# EAGLE schematic jr-support_v3 (EAGLE 8.2.1)
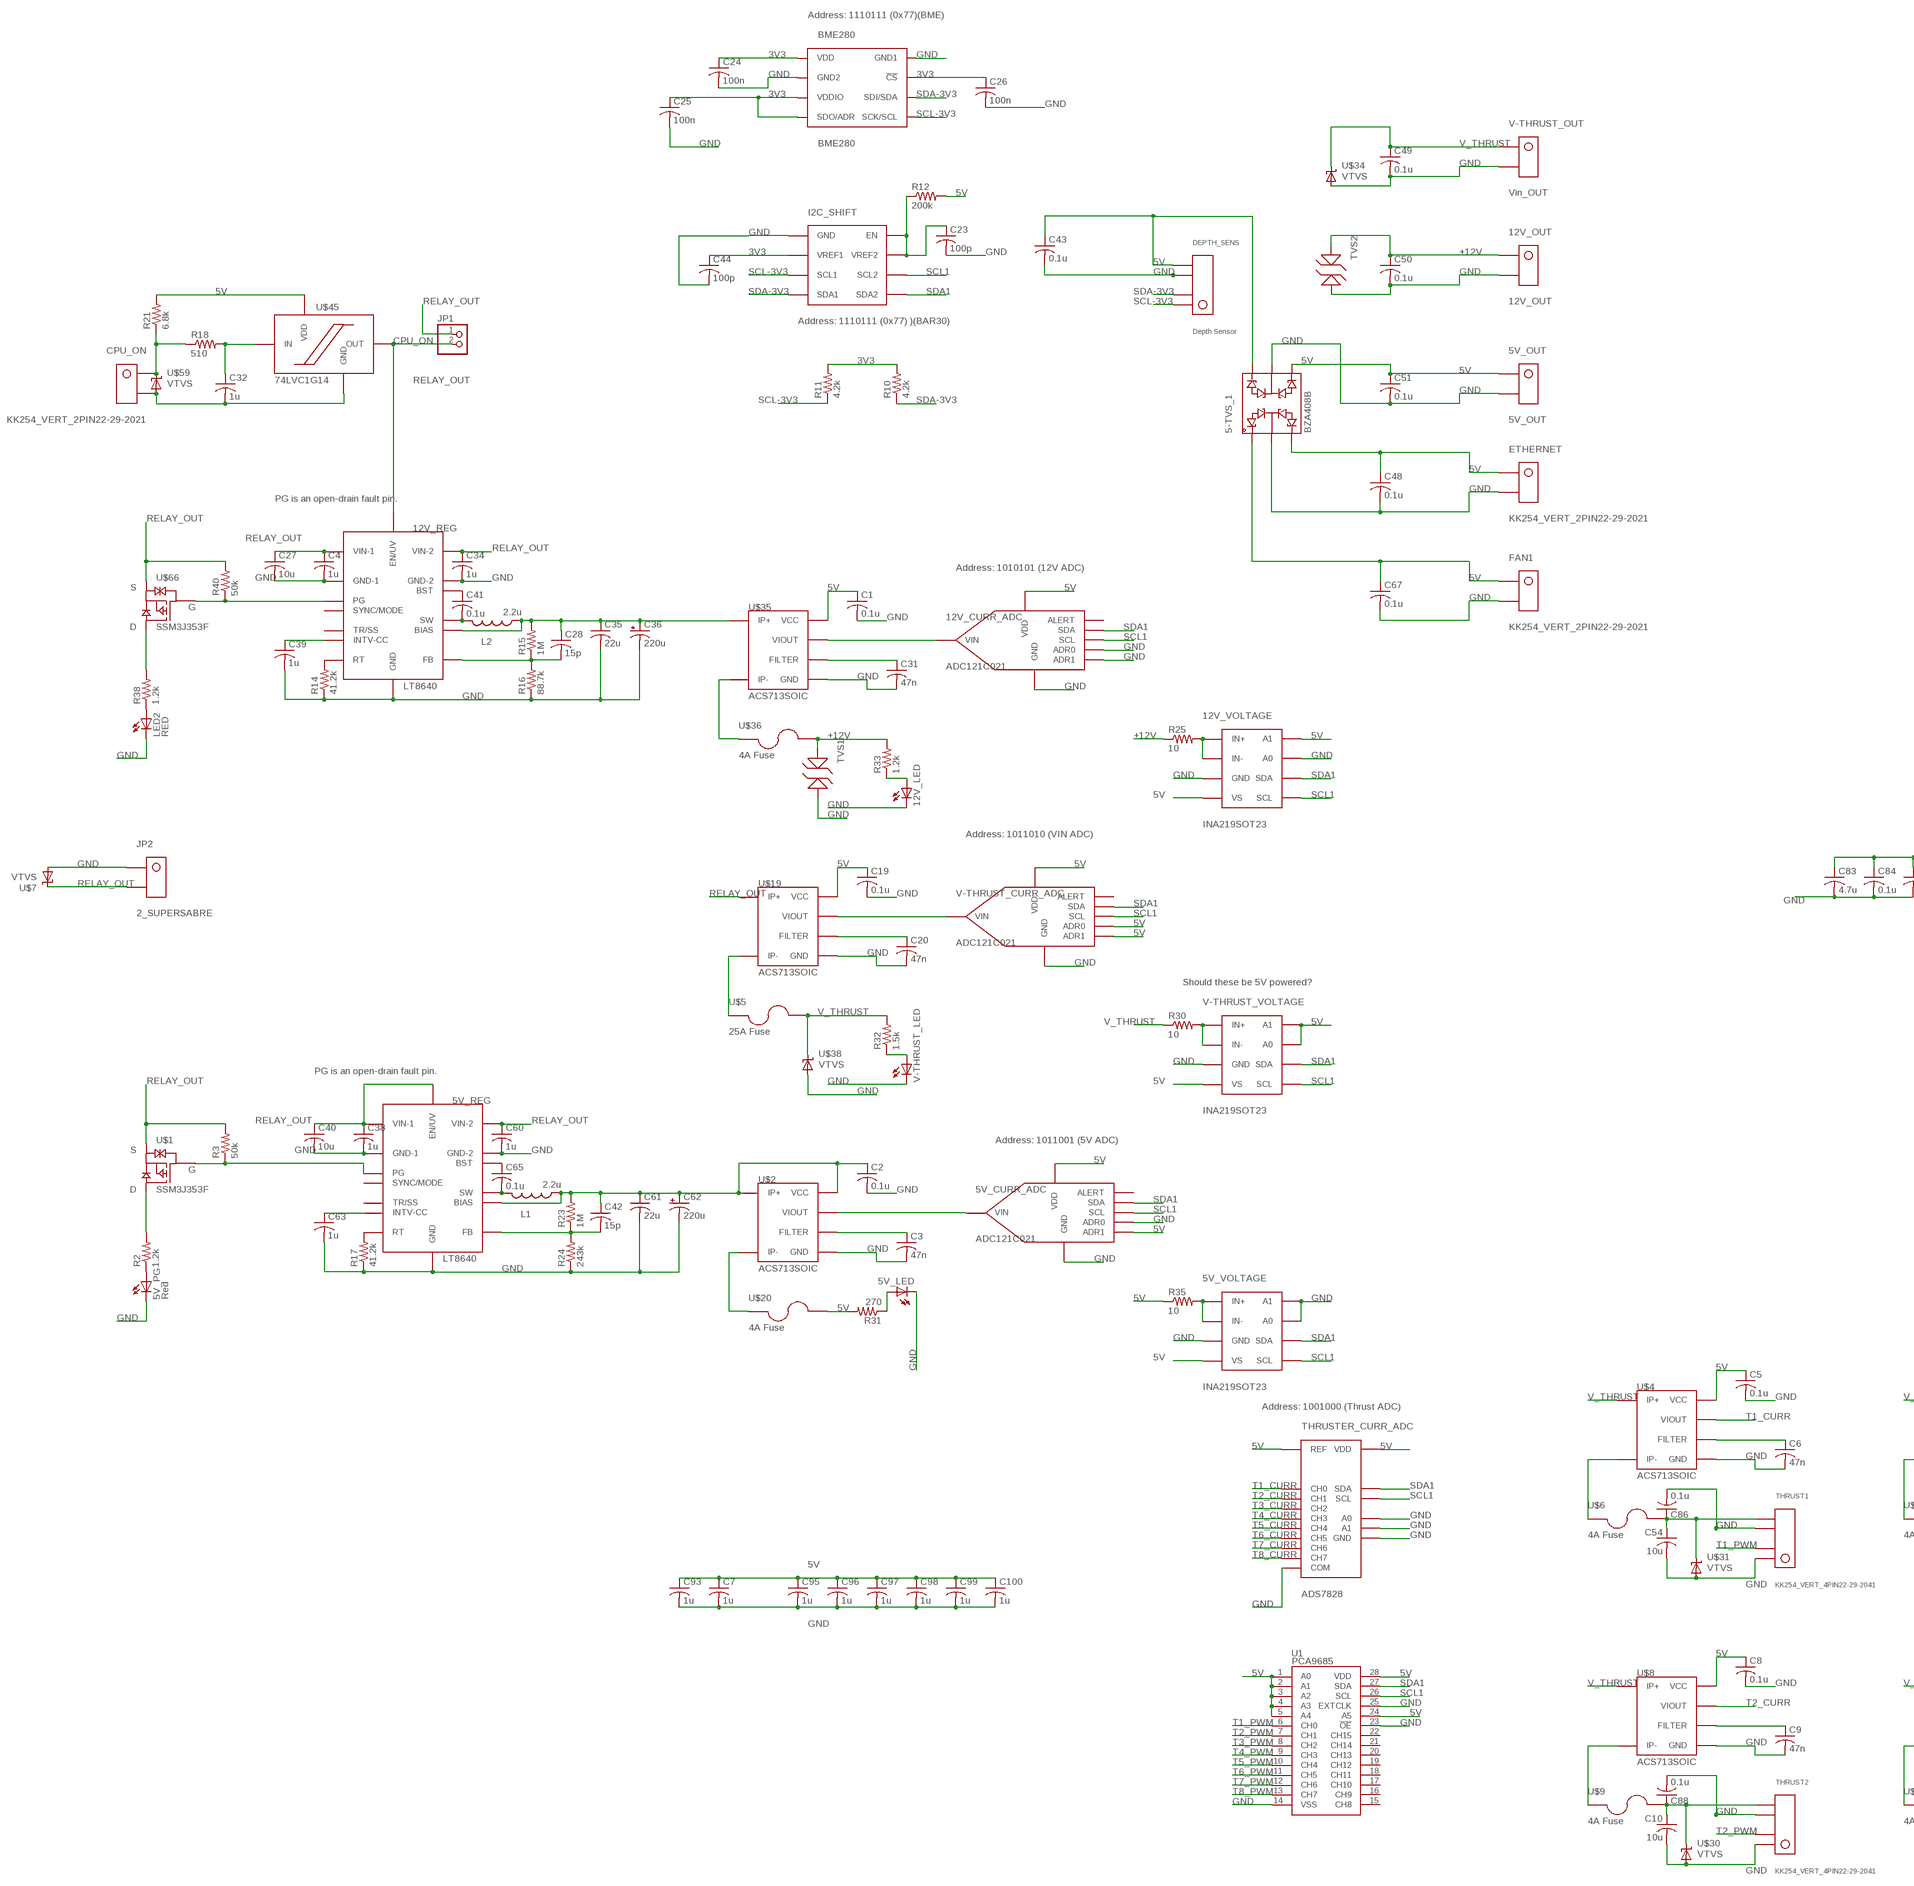
[diagram p0: schematic, sheet 1, part 1 of 2]
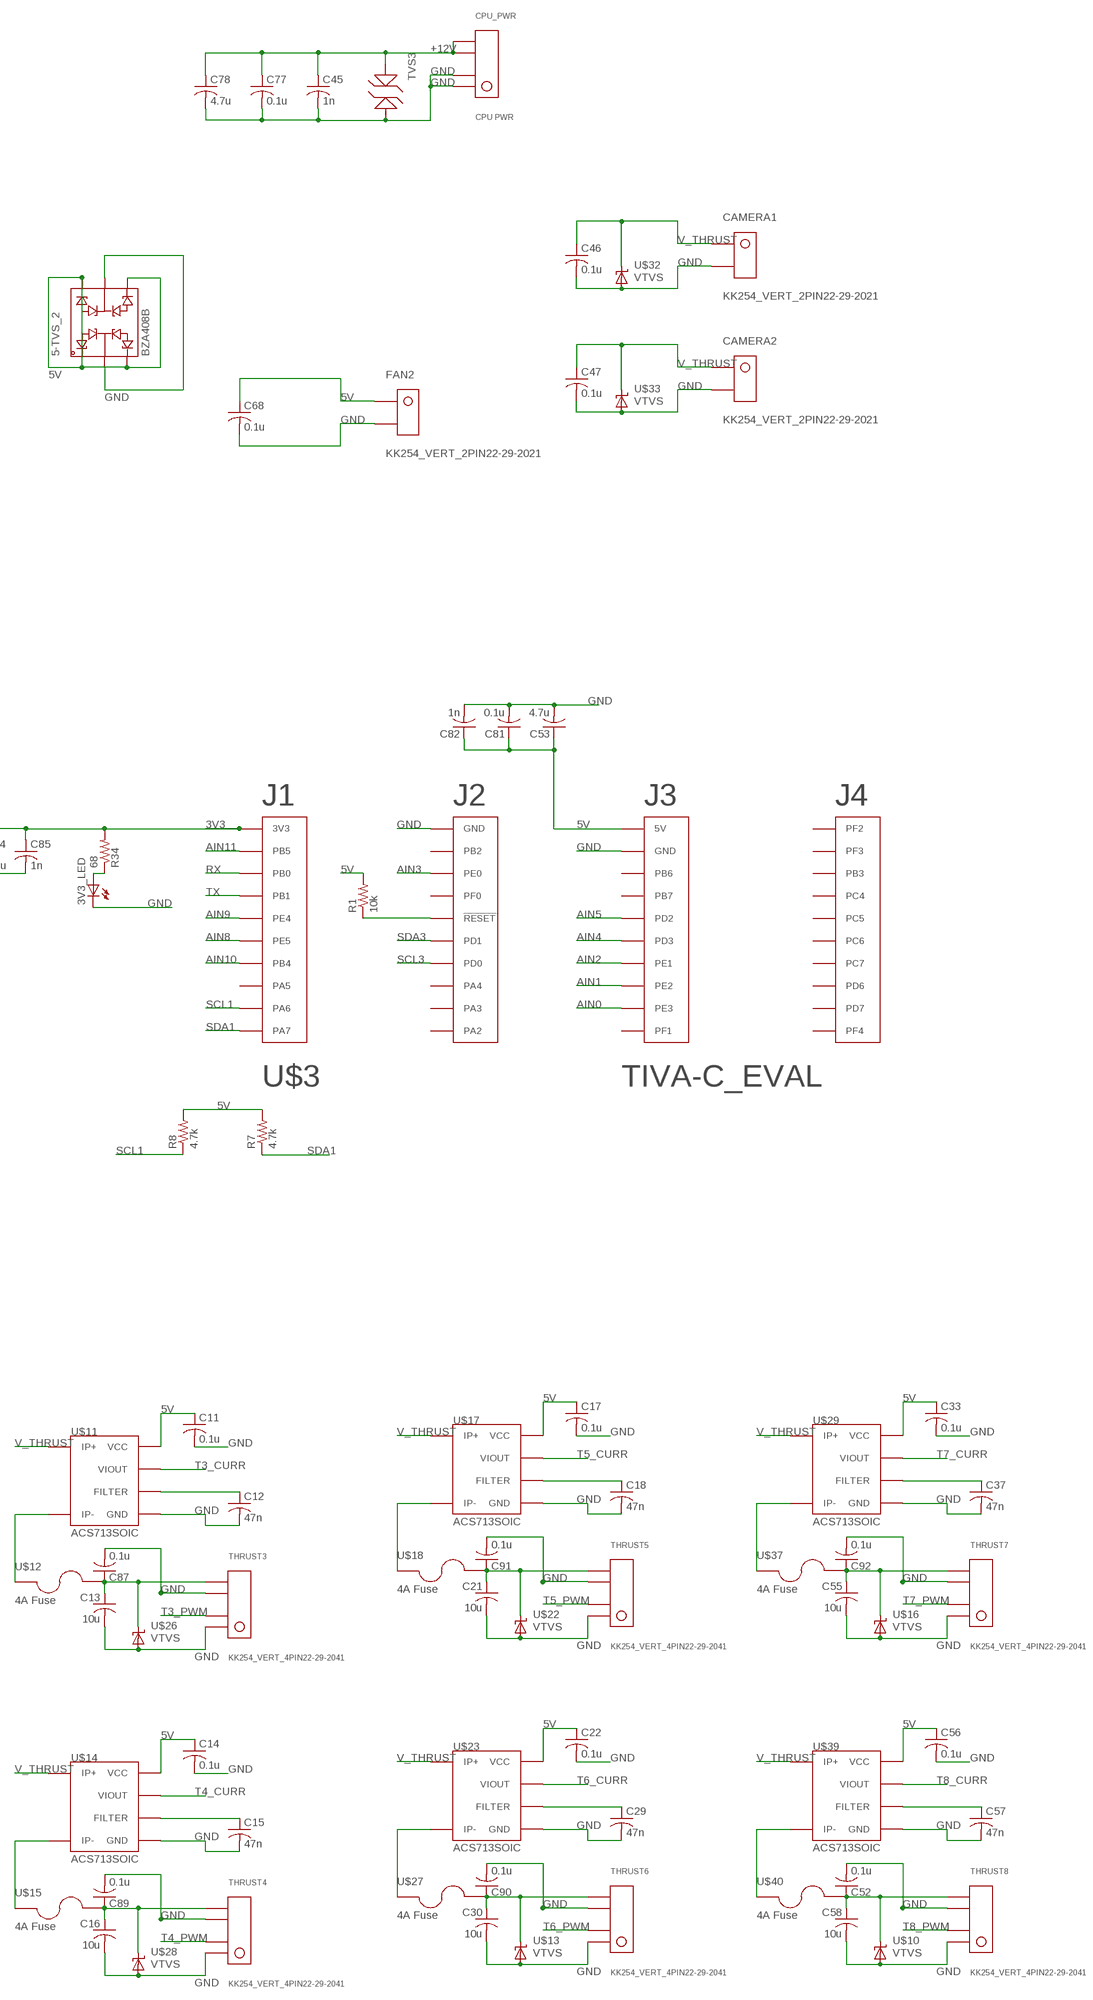
[diagram p1: schematic, sheet 1, part 2 of 2]

## Parts
3V3_LED  0805_LED  [0805]
5-TVS_1  BZA408B  [SOT457]
5-TVS_2  BZA408B  [SOT457]
5V_CURR_ADC  ADC121C021  [VSSOP-8]
5V_LED  0805_LED  [0805]
5V_OUT  5V_OUT  KK254_VERT_2PIN22-29-2021  [KK254_VERT_2PIN]
5V_PG  Red  LEDCHIP-LED0805  [CHIP-LED0805]
5V_REG  LT8640  [QFN18-3X4]
5V_VOLTAGE  INA219SOT23  [SOT-23-8]
12V_CURR_ADC  ADC121C021  [VSSOP-8]
12V_LED  0805_LED  [0805]
12V_OUT  12V_OUT  KK254_VERT_2PIN22-29-2021  [KK254_VERT_2PIN]
12V_REG  LT8640  [QFN18-3X4]
12V_VOLTAGE  INA219SOT23  [SOT-23-8]
BME280  BME280  [BME280_LGA]
C1  0.1u  C-USC0805  [C0805]
C2  0.1u  C-USC0805  [C0805]
C3  47n  C-USC0805  [C0805]
C4  1u  C-USC0805  [C0805]
C5  0.1u  C-USC0805  [C0805]
C6  47n  C-USC0805  [C0805]
C7  1u  C-USC0805  [C0805]
C8  0.1u  C-USC0805  [C0805]
C9  47n  C-USC0805  [C0805]
C10  10u  C-USC0805  [C0805]
C11  0.1u  C-USC0805  [C0805]
C12  47n  C-USC0805  [C0805]
C13  10u  C-USC0805  [C0805]
C14  0.1u  C-USC0805  [C0805]
C15  47n  C-USC0805  [C0805]
C16  10u  C-USC0805  [C0805]
C17  0.1u  C-USC0805  [C0805]
C18  47n  C-USC0805  [C0805]
C19  0.1u  C-USC0805  [C0805]
C20  47n  C-USC0805  [C0805]
C21  10u  C-USC0805  [C0805]
C22  0.1u  C-USC0805  [C0805]
C23  100p  C-USC0805  [C0805]
C24  100n  C-USC0805  [C0805]
C25  100n  C-USC0805  [C0805]
C26  100n  C-USC0805  [C0805]
C27  10u  C-USC0805  [C0805]
C28  15p  C-USC0805  [C0805]
C29  47n  C-USC0805  [C0805]
C30  10u  C-USC0805  [C0805]
C31  47n  C-USC0805  [C0805]
C32  1u  C-USC0805  [C0805]
C33  0.1u  C-USC0805  [C0805]
C34  1u  C-USC0805  [C0805]
C35  22u  C-USC0805  [C0805]
C36  220u  CPOL-USC-F80  [C-F80]
C37  47n  C-USC0805  [C0805]
C38  1u  C-USC0805  [C0805]
C39  1u  C-USC0805  [C0805]
C40  10u  C-USC0805  [C0805]
C41  0.1u  C-USC0805  [C0805]
C42  15p  C-USC0805  [C0805]
C43  0.1u  C-USC0805  [C0805]
C44  100p  C-USC0805  [C0805]
C45  1n  C-USC0805  [C0805]
C46  0.1u  C-USC0805  [C0805]
C47  0.1u  C-USC0805  [C0805]
C48  0.1u  C-USC0805  [C0805]
C49  0.1u  C-USC0805  [C0805]
C50  0.1u  C-USC0805  [C0805]
C51  0.1u  C-USC0805  [C0805]
C52  0.1u  C-USC0805  [C0805]
C53  4.7u  C-USC0805  [C0805]
C54  10u  C-USC0805  [C0805]
C55  10u  C-USC0805  [C0805]
C56  0.1u  C-USC0805  [C0805]
C57  47n  C-USC0805  [C0805]
C58  10u  C-USC0805  [C0805]
C60  1u  C-USC0805  [C0805]
C61  22u  C-USC0805  [C0805]
C62  220u  CPOL-USC-F80  [C-F80]
C63  1u  C-USC0805  [C0805]
C65  0.1u  C-USC0805  [C0805]
C67  0.1u  C-USC0805  [C0805]
C68  0.1u  C-USC0805  [C0805]
C77  0.1u  C-USC0805  [C0805]
C78  4.7u  C-USC0805  [C0805]
C81  0.1u  C-USC0805  [C0805]
C82  1n  C-USC0805  [C0805]
C83  4.7u  C-USC0805  [C0805]
C84  0.1u  C-USC0805  [C0805]
C85  1n  C-USC0805  [C0805]
C86  0.1u  C-USC0805  [C0805]
C87  0.1u  C-USC0805  [C0805]
C88  0.1u  C-USC0805  [C0805]
C89  0.1u  C-USC0805  [C0805]
C90  0.1u  C-USC0805  [C0805]
C91  0.1u  C-USC0805  [C0805]
C92  0.1u  C-USC0805  [C0805]
C93  1u  C-USC0805  [C0805]
C95  1u  C-USC0805  [C0805]
C96  1u  C-USC0805  [C0805]
C97  1u  C-USC0805  [C0805]
C98  1u  C-USC0805  [C0805]
C99  1u  C-USC0805  [C0805]
C100  1u  C-USC0805  [C0805]
CAMERA1  KK254_VERT_2PIN22-29-2021  [KK254_VERT_2PIN]
CAMERA2  KK254_VERT_2PIN22-29-2021  [KK254_VERT_2PIN]
CPU_ON  KK254_VERT_2PIN22-29-2021  [KK254_VERT_2PIN]
CPU_PWR  CPU PWR  KK254_VERT_4PIN22-29-2041  [KK254_VERT_4PIN]
DEPTH_SENS  Depth Sensor  KK254_VERT_4PIN22-29-2041  [KK254_VERT_4PIN]
ETHERNET  KK254_VERT_2PIN22-29-2021  [KK254_VERT_2PIN]
FAN1  KK254_VERT_2PIN22-29-2021  [KK254_VERT_2PIN]
FAN2  KK254_VERT_2PIN22-29-2021  [KK254_VERT_2PIN]
I2C_SHIFT  PCA9306DCT  [SM8]
JP1  PINHD-1X2  [1X02]
JP2  2_SUPERSABRE  [SUPERSABRE_2CIRCUIT]
L1  2.2u  L-USL0740  [L0740]
L2  2.2u  L-USL0740  [L0740]
LED2  RED  LEDCHIP-LED0805  [CHIP-LED0805]
R1  10k  R-US_R0805  [R0805]
R2  1.2k  R-US_R0805  [R0805]
R3  50k  R-US_R0805  [R0805]
R7  4.7k  R-US_R0805  [R0805]
R8  4.7k  R-US_R0805  [R0805]
R10  4.2k  R-US_R0805  [R0805]
R11  4.2k  R-US_R0805  [R0805]
R12  200k  R-US_R0805  [R0805]
R14  41.2k  R-US_R0805  [R0805]
R15  1M  R-US_R0805  [R0805]
R16  88.7k  R-US_R0805  [R0805]
R17  41.2k  R-US_R0805  [R0805]
R18  510  R-US_R0805  [R0805]
R21  6.8k  R-US_R0805  [R0805]
R23  1M  R-US_R0805  [R0805]
R24  243k  R-US_R0805  [R0805]
R25  10  R-US_R0805  [R0805]
R30  10  R-US_R0805  [R0805]
R31  270  R-US_R0805  [R0805]
R32  1.5k  R-US_R0805  [R0805]
R33  1.2k  R-US_R0805  [R0805]
R34  68  R-US_R0805  [R0805]
R35  10  R-US_R0805  [R0805]
R38  1.2k  R-US_R0805  [R0805]
R40  50k  R-US_R0805  [R0805]
THRUST1  KK254_VERT_4PIN22-29-2041  [KK254_VERT_4PIN]
THRUST2  KK254_VERT_4PIN22-29-2041  [KK254_VERT_4PIN]
THRUST3  KK254_VERT_4PIN22-29-2041  [KK254_VERT_4PIN]
THRUST4  KK254_VERT_4PIN22-29-2041  [KK254_VERT_4PIN]
THRUST5  KK254_VERT_4PIN22-29-2041  [KK254_VERT_4PIN]
THRUST6  KK254_VERT_4PIN22-29-2041  [KK254_VERT_4PIN]
THRUST7  KK254_VERT_4PIN22-29-2041  [KK254_VERT_4PIN]
THRUST8  KK254_VERT_4PIN22-29-2041  [KK254_VERT_4PIN]
THRUSTER_CURR_ADC  ADS7828  [TSSOP16]
TVS1  ESD12VD3B  [SOD-323]
TVS2  ESD12VD3B  [SOD-323]
TVS3  ESD12VD3B  [SOD-323]
U1  PCA9685  [TSSOP-28_4MM]
U$1  SSM3J353F  [SOT-346-3/S-MINI]
U$2  ACS713SOIC  [ACS713-SOIC]
U$3  TIVA-C_EVAL  [TIVA-C_EVAL]
U$4  ACS713SOIC  [ACS713-SOIC]
U$5  25A Fuse  BOWED-1.25"-FUSECLIPS  [1.25"_FUSECLIPS]
U$6  4A Fuse  154-OMNI_BLOK  [154-OMNI-BLOK]
U$7  VTVS  [DO-219AB]
U$8  ACS713SOIC  [ACS713-SOIC]
U$9  4A Fuse  154-OMNI_BLOK  [154-OMNI-BLOK]
U$10  VTVS  [DO-219AB]
U$11  ACS713SOIC  [ACS713-SOIC]
U$12  4A Fuse  154-OMNI_BLOK  [154-OMNI-BLOK]
U$13  VTVS  [DO-219AB]
U$14  ACS713SOIC  [ACS713-SOIC]
U$15  4A Fuse  154-OMNI_BLOK  [154-OMNI-BLOK]
U$16  VTVS  [DO-219AB]
U$17  ACS713SOIC  [ACS713-SOIC]
U$18  4A Fuse  154-OMNI_BLOK  [154-OMNI-BLOK]
U$19  ACS713SOIC  [ACS713-SOIC]
U$20  4A Fuse  154-OMNI_BLOK  [154-OMNI-BLOK]
U$22  VTVS  [DO-219AB]
U$23  ACS713SOIC  [ACS713-SOIC]
U$26  VTVS  [DO-219AB]
U$27  4A Fuse  154-OMNI_BLOK  [154-OMNI-BLOK]
U$28  VTVS  [DO-219AB]
U$29  ACS713SOIC  [ACS713-SOIC]
U$30  VTVS  [DO-219AB]
U$31  VTVS  [DO-219AB]
U$32  VTVS  [DO-219AB]
U$33  VTVS  [DO-219AB]
U$34  VTVS  [DO-219AB]
U$35  ACS713SOIC  [ACS713-SOIC]
U$36  4A Fuse  154-OMNI_BLOK  [154-OMNI-BLOK]
U$37  4A Fuse  154-OMNI_BLOK  [154-OMNI-BLOK]
U$38  VTVS  [DO-219AB]
U$39  ACS713SOIC  [ACS713-SOIC]
U$40  4A Fuse  154-OMNI_BLOK  [154-OMNI-BLOK]
U$45  74LVC1G14  [TSSOP5]
U$59  VTVS  [DO-219AB]
U$66  SSM3J353F  [SOT-346-3/S-MINI]
V-THRUST_CURR_ADC  ADC121C021  [VSSOP-8]
V-THRUST_LED  0805_LED  [0805]
V-THRUST_OUT  Vin_OUT  KK254_VERT_2PIN22-29-2021  [KK254_VERT_2PIN]
V-THRUST_VOLTAGE  INA219SOT23  [SOT-23-8]

## Nets
3V3: BME280.P$2(!CS) BME280.P$5(SDO/ADR) BME280.P$6(VDDIO) BME280.P$8(VDD) C24.1 C25.1 C26.1 C44.1 C83.1 C84.1 C85.1 I2C_SHIFT.P$2(VREF1) R10.2 R11.2 R34.2 U$3.1-1(3V3)
5V: 5-TVS_1.P$1 5-TVS_1.P$3 5-TVS_1.P$4 5-TVS_1.P$6 5-TVS_2.P$1 5-TVS_2.P$3 5-TVS_2.P$4 5-TVS_2.P$6 5V_CURR_ADC.P$5(VDD) 5V_CURR_ADC.P$6(ADR1) 5V_OUT.P$1 5V_VOLTAGE.P$4(VS) 12V_CURR_ADC.P$5(VDD) 12V_VOLTAGE.P$4(VS) 12V_VOLTAGE.P$8(A1) C1.1 C5.1 C7.1 C8.1 C11.1 C14.1 C17.1 C19.1 C22.1 C33.1 C43.1 C48.1 C51.1 C53.1 C56.1 C67.1 C68.1 C81.1 C82.1 C93.1 C95.1 C96.1 C97.1 C98.1 C99.1 C100.1 DEPTH_SENS.P$4 ETHERNET.P$1 FAN1.P$1 FAN2.P$1 R1.2 R7.2 R8.2 R12.2 R21.2 R31.2 R35.1 THRUSTER_CURR_ADC.10(REF) THRUSTER_CURR_ADC.16(VDD) U1.1(A0) U1.2(A1) U1.3(A2) U1.4(A3) U1.5(A4) U1.24(A5) U1.28(VDD) U$3.3-1(5V) U$4.P$8(VCC) U$8.P$8(VCC) U$11.P$8(VCC) U$14.P$8(VCC) U$17.P$8(VCC) U$19.P$8(VCC) U$20.P$2 U$23.P$8(VCC) U$29.P$8(VCC) U$35.P$8(VCC) U$39.P$8(VCC) U$45.P$5(VDD) V-THRUST_CURR_ADC.P$3(ADR0) V-THRUST_CURR_ADC.P$5(VDD) V-THRUST_CURR_ADC.P$6(ADR1) V-THRUST_VOLTAGE.P$4(VS) V-THRUST_VOLTAGE.P$7(A0) V-THRUST_VOLTAGE.P$8(A1)
+12V: 12V_OUT.P$1 C45.1 C50.1 C77.1 C78.1 CPU_PWR.P$3 CPU_PWR.P$4 R25.1 R33.2 TVS1.P$1 TVS2.P$1 TVS3.P$1 U$36.P$2
AIN0: U$3.3-9(PE3)
AIN1: U$3.3-8(PE2)
AIN2: U$3.3-7(PE1)
AIN3: U$3.2-3(PE0)
AIN4: U$3.3-6(PD3)
AIN5: U$3.3-5(PD2)
AIN8: U$3.1-6(PE5)
AIN9: U$3.1-5(PE4)
AIN10: U$3.1-7(PB4)
AIN11: U$3.1-2(PB5)
CPU_ON: 12V_REG.14(EN/UV) JP1.2 U$45.P$4(OUT)
GND: 3V3_LED.P$2(C) 5-TVS_1.P$2 5-TVS_1.P$5 5-TVS_2.P$2 5-TVS_2.P$5 5V_CURR_ADC.P$3(ADR0) 5V_CURR_ADC.P$7(GND) 5V_LED.P$2(C) 5V_OUT.P$2 5V_PG.C 5V_REG.6(GND-1) 5V_REG.7(GND-1) 5V_REG.10(GND-2) 5V_REG.11(GND-2) 5V_REG.18(GND) 5V_VOLTAGE.P$3(GND) 5V_VOLTAGE.P$7(A0) 5V_VOLTAGE.P$8(A1) 12V_CURR_ADC.P$3(ADR0) 12V_CURR_ADC.P$6(ADR1) 12V_CURR_ADC.P$7(GND) 12V_LED.P$2(C) 12V_OUT.P$2 12V_REG.6(GND-1) 12V_REG.7(GND-1) 12V_REG.10(GND-2) 12V_REG.11(GND-2) 12V_REG.18(GND) 12V_VOLTAGE.P$3(GND) 12V_VOLTAGE.P$7(A0) BME280.P$1(GND1) BME280.P$7(GND2) C1.2 C2.2 C3.2 C4.2 C5.2 C6.2 C7.2 C8.2 C9.2 C10.2 C11.2 C12.2 C13.2 C14.2 C15.2 C16.2 C17.2 C18.2 C19.2 C20.2 C21.2 C22.2 C23.2 C24.2 C25.2 C26.2 C27.2 C29.2 C30.2 C31.2 C32.2 C33.2 C34.2 C35.2 C36.P$2(-) C37.2 C38.2 C39.2 C40.2 C43.2 C44.2 C45.2 C46.2 C47.2 C48.2 C49.2 C50.2 C51.2 C52.2 C53.2 C54.2 C55.2 C56.2 C57.2 C58.2 C60.2 C61.2 C62.P$2(-) C63.2 C67.2 C68.2 C77.2 C78.2 C81.2 C82.2 C83.2 C84.2 C85.2 C86.2 C87.2 C88.2 C89.2 C90.2 C91.2 C92.2 C93.2 C95.2 C96.2 C97.2 C98.2 C99.2 C100.2 CAMERA1.P$2 CAMERA2.P$2 CPU_ON.P$2 CPU_PWR.P$1 CPU_PWR.P$2 DEPTH_SENS.P$3 ETHERNET.P$2 FAN1.P$2 FAN2.P$2 I2C_SHIFT.P$1(GND) JP2.P$1 LED2.C R14.1 R16.1 R17.1 R24.1 THRUST1.P$1 THRUST1.P$3 THRUST2.P$1 THRUST2.P$3 THRUST3.P$1 THRUST3.P$3 THRUST4.P$1 THRUST4.P$3 THRUST5.P$1 THRUST5.P$3 THRUST6.P$1 THRUST6.P$3 THRUST7.P$1 THRUST7.P$3 THRUST8.P$1 THRUST8.P$3 THRUSTER_CURR_ADC.9(GND) THRUSTER_CURR_ADC.11(COM) THRUSTER_CURR_ADC.12(A0) THRUSTER_CURR_ADC.13(A1) TVS1.P$2 TVS2.P$2 TVS3.P$2 U1.14(VSS) U1.23(!OE) U1.25(EXTCLK) U$2.P$5(GND) U$3.2-1(GND) U$3.3-2(GND) U$4.P$5(GND) U$7.P$1(A) U$8.P$5(GND) U$10.P$1(A) U$11.P$5(GND) U$13.P$1(A) U$14.P$5(GND) U$16.P$1(A) U$17.P$5(GND) U$19.P$5(GND) U$22.P$1(A) U$23.P$5(GND) U$26.P$1(A) U$28.P$1(A) U$29.P$5(GND) U$30.P$1(A) U$31.P$1(A) U$32.P$1(A) U$33.P$1(A) U$34.P$1(A) U$35.P$5(GND) U$38.P$1(A) U$39.P$5(GND) U$45.P$3(GND) U$59.P$1(A) V-THRUST_CURR_ADC.P$7(GND) V-THRUST_LED.P$2(C) V-THRUST_OUT.P$2 V-THRUST_VOLTAGE.P$3(GND)
N$1: 12V_REG.15(RT) R14.2
N$2: R1.1 U$3.2-5(!RESET!)
N$4: 5V_PG.A R2.1
N$5: R2.2 U$1.P$2(D)
N$6: 5V_REG.19(PG) R3.1 U$1.P$1(G)
N$7: 12V_REG.1(BIAS) C28.1 C35.1 C36.P$1(+) L2.P$2 R15.2 U$35.P$1(IP+) U$35.P$2(IP+)
N$8: 5V_REG.15(RT) R17.2
N$11: C3.1 U$2.P$6(FILTER)
N$12: C9.1 U$8.P$6(FILTER)
N$13: C6.1 U$4.P$6(FILTER)
N$14: C54.1 C86.1 THRUST1.P$4 U$6.P$2 U$31.P$2(C)
N$15: U$4.P$3(IP-) U$4.P$4(IP-) U$6.P$1
N$16: C10.1 C88.1 THRUST2.P$4 U$9.P$2 U$30.P$2(C)
N$17: U$8.P$3(IP-) U$8.P$4(IP-) U$9.P$1
N$18: C12.1 U$11.P$6(FILTER)
N$19: C13.1 C87.1 THRUST3.P$4 U$12.P$2 U$26.P$2(C)
N$20: U$11.P$3(IP-) U$11.P$4(IP-) U$12.P$1
N$21: C15.1 U$14.P$6(FILTER)
N$22: C16.1 C89.1 THRUST4.P$4 U$15.P$2 U$28.P$2(C)
N$24: U$14.P$3(IP-) U$14.P$4(IP-) U$15.P$1
N$25: C18.1 U$17.P$6(FILTER)
N$26: C21.1 C91.1 THRUST5.P$4 U$18.P$2 U$22.P$2(C)
N$27: U$17.P$3(IP-) U$17.P$4(IP-) U$18.P$1
N$28: C29.1 U$23.P$6(FILTER)
N$29: C30.1 C90.1 THRUST6.P$4 U$13.P$2(C) U$27.P$2
N$30: U$23.P$3(IP-) U$23.P$4(IP-) U$27.P$1
N$31: C37.1 U$29.P$6(FILTER)
N$32: 12V_REG.8(SW) 12V_REG.9(SW) 12V_REG.21(SW) 12V_REG.22(SW) C41.2 L2.P$1
N$33: C20.1 U$19.P$6(FILTER)
N$34: U$5.P$1 U$5.P$2 U$19.P$3(IP-) U$19.P$4(IP-)
N$36: C55.1 C92.1 THRUST7.P$4 U$16.P$2(C) U$37.P$2
N$37: U$29.P$3(IP-) U$29.P$4(IP-) U$37.P$1
N$38: C57.1 U$39.P$6(FILTER)
N$39: C52.1 C58.1 THRUST8.P$4 U$10.P$2(C) U$40.P$2
N$40: 5V_REG.8(SW) 5V_REG.9(SW) 5V_REG.21(SW) 5V_REG.22(SW) C65.2 L1.P$1
N$41: C23.1 I2C_SHIFT.P$7(VREF2) I2C_SHIFT.P$8(EN) R12.1
N$42: 5V_REG.20(FB) C42.2 R23.1 R24.2
N$43: 5V_REG.3(BST) C65.1
N$44: 12V_REG.20(FB) C28.2 R15.1 R16.2
N$45: 12V_REG.3(BST) C41.1
N$47: U$39.P$3(IP-) U$39.P$4(IP-) U$40.P$1
N$48: 5V_REG.2(INTV-CC) C63.1
N$49: 12V_VOLTAGE.P$1(IN+) 12V_VOLTAGE.P$2(IN-) R25.2
N$52: C31.1 U$35.P$6(FILTER)
N$53: U$19.P$7(VIOUT) V-THRUST_CURR_ADC.P$4(VIN)
N$54: 12V_REG.2(INTV-CC) C39.1
N$55: U$2.P$3(IP-) U$2.P$4(IP-) U$20.P$1
N$56: U$35.P$3(IP-) U$35.P$4(IP-) U$36.P$1
N$57: 5V_CURR_ADC.P$4(VIN) U$2.P$7(VIOUT)
N$58: R30.2 V-THRUST_VOLTAGE.P$1(IN+) V-THRUST_VOLTAGE.P$2(IN-)
N$59: C32.1 R18.2 U$45.P$2(IN)
N$60: 12V_CURR_ADC.P$4(VIN) U$35.P$7(VIOUT)
N$61: CPU_ON.P$1 R18.1 R21.1 U$59.P$2(C)
N$71: 5V_LED.P$1(A) R31.1
N$72: R32.1 V-THRUST_LED.P$1(A)
N$73: 12V_LED.P$1(A) R33.1
N$74: 3V3_LED.P$1(A) R34.1
N$77: 5V_VOLTAGE.P$1(IN+) 5V_VOLTAGE.P$2(IN-) R35.2
N$78: LED2.A R38.1
N$79: R38.2 U$66.P$2(D)
N$80: 12V_REG.19(PG) R40.1 U$66.P$1(G)
RELAY_OUT: 5V_REG.4(VIN-1) 5V_REG.13(VIN-2) 5V_REG.14(EN/UV) 12V_REG.4(VIN-1) 12V_REG.13(VIN-2) C4.1 C27.1 C34.1 C38.1 C40.1 C60.1 JP1.1 JP2.P$2 R3.2 R40.2 U$1.P$3(S) U$7.P$2(C) U$19.P$1(IP+) U$19.P$2(IP+) U$66.P$3(S)
RX: U$3.1-3(PB0)
SCL1: 5V_CURR_ADC.P$1(SCL) 5V_VOLTAGE.P$5(SCL) 12V_CURR_ADC.P$1(SCL) 12V_VOLTAGE.P$5(SCL) I2C_SHIFT.P$6(SCL2) R8.1 THRUSTER_CURR_ADC.14(SCL) U1.26(SCL) U$3.1-9(PA6) V-THRUST_CURR_ADC.P$1(SCL) V-THRUST_VOLTAGE.P$5(SCL)
SCL3: U$3.2-7(PD0)
SCL-3V3: BME280.P$4(SCK/SCL) DEPTH_SENS.P$1 I2C_SHIFT.P$3(SCL1) R11.1
SDA1: 5V_CURR_ADC.P$8(SDA) 5V_VOLTAGE.P$6(SDA) 12V_CURR_ADC.P$8(SDA) 12V_VOLTAGE.P$6(SDA) I2C_SHIFT.P$5(SDA2) R7.1 THRUSTER_CURR_ADC.15(SDA) U1.27(SDA) U$3.1-10(PA7) V-THRUST_CURR_ADC.P$8(SDA) V-THRUST_VOLTAGE.P$6(SDA)
SDA3: U$3.2-6(PD1)
SDA-3V3: BME280.P$3(SDI/SDA) DEPTH_SENS.P$2 I2C_SHIFT.P$4(SDA1) R10.1
SW-5V: 5V_REG.1(BIAS) C2.1 C42.1 C61.1 C62.P$1(+) L1.P$2 R23.2 U$2.P$1(IP+) U$2.P$2(IP+) U$2.P$8(VCC)
T1_CURR: THRUSTER_CURR_ADC.1(CH0) U$4.P$7(VIOUT)
T1_PWM: THRUST1.P$2 U1.6(CH0)
T2_CURR: THRUSTER_CURR_ADC.2(CH1) U$8.P$7(VIOUT)
T2_PWM: THRUST2.P$2 U1.7(CH1)
T3_CURR: THRUSTER_CURR_ADC.3(CH2) U$11.P$7(VIOUT)
T3_PWM: THRUST3.P$2 U1.8(CH2)
T4_CURR: THRUSTER_CURR_ADC.4(CH3) U$14.P$7(VIOUT)
T4_PWM: THRUST4.P$2 U1.9(CH3)
T5_CURR: THRUSTER_CURR_ADC.5(CH4) U$17.P$7(VIOUT)
T5_PWM: THRUST5.P$2 U1.10(CH4)
T6_CURR: THRUSTER_CURR_ADC.6(CH5) U$23.P$7(VIOUT)
T6_PWM: THRUST6.P$2 U1.11(CH5)
T7_CURR: THRUSTER_CURR_ADC.7(CH6) U$29.P$7(VIOUT)
T7_PWM: THRUST7.P$2 U1.12(CH6)
T8_CURR: THRUSTER_CURR_ADC.8(CH7) U$39.P$7(VIOUT)
T8_PWM: THRUST8.P$2 U1.13(CH7)
TX: U$3.1-4(PB1)
V_THRUST: C46.1 C47.1 C49.1 CAMERA1.P$1 CAMERA2.P$1 R30.1 R32.2 U$4.P$1(IP+) U$4.P$2(IP+) U$5.P$3 U$5.P$4 U$8.P$1(IP+) U$8.P$2(IP+) U$11.P$1(IP+) U$11.P$2(IP+) U$14.P$1(IP+) U$14.P$2(IP+) U$17.P$1(IP+) U$17.P$2(IP+) U$23.P$1(IP+) U$23.P$2(IP+) U$29.P$1(IP+) U$29.P$2(IP+) U$32.P$2(C) U$33.P$2(C) U$34.P$2(C) U$38.P$2(C) U$39.P$1(IP+) U$39.P$2(IP+) V-THRUST_OUT.P$1
Unconnected: 5V_CURR_ADC.P$2(ALERT) 5V_REG.16(TR/SS) 5V_REG.17(SYNC/MODE) 12V_CURR_ADC.P$2(ALERT) 12V_REG.16(TR/SS) 12V_REG.17(SYNC/MODE) U1.15(CH8) U1.16(CH9) U1.17(CH10) U1.18(CH11) U1.19(CH12) U1.20(CH13) U1.21(CH14) U1.22(CH15) U$3.1-8(PA5) U$3.2-2(PB2) U$3.2-4(PF0) U$3.2-8(PA4) U$3.2-9(PA3) U$3.2-10(PA2) U$3.3-3(PB6) U$3.3-4(PB7) U$3.3-10(PF1) U$3.4-1(PF2) U$3.4-2(PF3) U$3.4-3(PB3) U$3.4-4(PC4) U$3.4-5(PC5) U$3.4-6(PC6) U$3.4-7(PC7) U$3.4-8(PD6) U$3.4-9(PD7) U$3.4-10(PF4) V-THRUST_CURR_ADC.P$2(ALERT)

## Notes on the sheet
- Address: 1110111 (0x77)(BME)
- Address: 1110111 (0x77) )(BAR30)
- PG is an open-drain fault pin.
- Address: 1010101 (12V ADC)
- Address: 1011010 (VIN ADC)
- Should these be 5V powered?
- PG is an open-drain fault pin.
- Address: 1011001 (5V ADC)
- Address: 1001000 (Thrust ADC)

## Library data of the parts
3V3_LED 5V_LED 12V_LED V-THRUST_LED = led:0805_LED: LED, 0805 package. Any variety.
5-TVS_1 5-TVS_2 = diodes:BZA408B: Nexperia BZA408B 5V TVS diode Datasheet <http://www.mouser.com/ds/2/302/BZA408B-841090.pdf>
5V_CURR_ADC 12V_CURR_ADC V-THRUST_CURR_ADC = texas:ADC121C021: ADC121C021 8-pin VSSOP package 1 channel, 12-bit I2C ADC Datasheet <http://www.ti.com/lit/ds/symlink/adc121c021.pdf>
5V_OUT 12V_OUT CAMERA1 CAMERA2 CPU_ON ETHERNET FAN1 FAN2 V-THRUST_OUT = molex:KK254_VERT_2PIN: KK® 254 Wire-to-Board Header, Vertical, with Friction Lock, 2 Circuits, Gold (Au) Plating Part Number: 22-29-2021 http://www.molex.com/molex/products/datasheet.jsp?part=active/0022292021_PCB_HEADERS.xml
5V_PG LED2 = led:LED: LED OSRAM: - CHIPLED LG R971, LG N971, LY N971, LG Q971, LY Q971, LO R971, LY R971 LH N974, LH R974 LS Q976, LO Q976, LY Q976 LO Q996 - Hyper CHIPLED LW Q18S LB Q993, LB Q99A, LB R99A - SideLED LS A670, LO A670, LY A670, LG A670, LP A670 LB A673, LV A673, LT A673, LW A673 LH A674 LY A675 LS A676, LA A676, LO A676, LY A676, LW A676 LS A679, LY A679, LG A679 - Hyper Micro SIDELED® LS Y876, LA Y876, LO Y876, LY Y876 LT Y87S - SmartLED LW L88C, LW L88S LB L89C, LB L89S, LG L890 LS L89K, LO L89K, LY L89K LS L896, LA L896, LO L896, LY L896 - TOPLED LS T670, LO T670, LY T670, LG T670, LP T670 LSG T670, LSP T670, LSY T670, LOP T670, LYG T670 LG T671, LOG T671, LSG T671 LB T673, LV T673, LT T673, LW T673 LH T674 LS T676, LA T676, LO T676, LY T676, LB T676, LH T676, LSB T676, LW T676 LB T67C, LV T67C, LT T67C, LS T67K, LO T67K, LY T67K, LW E67C LS E67B, LA E67B, LO E67B, LY E67B, LB E67C, LV E67C, LT E67C LW T67C LS T679, LY T679, LG T679 LS T770, LO T770, LY T770, LG T770, LP T770 LB T773, LV T773, LT T773, LW T773 LH T774 LS E675, LA E675, LY E675, LS T675 LS T776, LA T776, LO T776, LY T776, LB T776 LHGB T686 LT T68C, LB T68C - Hyper Mini TOPLED® LB M676 - Mini TOPLED Santana® LG M470 LS M47K, LO M47K, LY M47K Source: http://www.osram.convergy.de LUXEON: - LUMILED® LXK2-PW12-R00, LXK2-PW12-S00, LXK2-PW14-U00, LXK2-PW14-V00 LXK2-PM12-R00, LXK2-PM12-S00, LXK2-PM14-U00 LXK2-PE12-Q00, LXK2-PE12-R00, LXK2-PE12-S00, LXK2-PE14-T00, LXK2-PE14-U00 LXK2-PB12-K00, LXK2-PB12-L00, LXK2-PB12-M00, LXK2-PB14-N00, LXK2-PB14-P00, LXK2-PB14-Q00 LXK2-PR12-L00, LXK2-PR12-M00, LXK2-PR14-Q00, LXK2-PR14-R00 LXK2-PD12-Q00, LXK2-PD12-R00, LXK2-PD12-S00 LXK2-PH12-R00, LXK2-PH12-S00 LXK2-PL12-P00, LXK2-PL12-Q00, LXK2-PL12-R00 Source: www.luxeon.com KINGBRIGHT: KA-3528ASYC Source: www.kingbright.com
5V_REG 12V_REG = linear:LT8640: Linear LT8640 Buck converter Datasheet <https://cds.linear.com/docs/en/datasheet/8640fa.pdf>
5V_VOLTAGE 12V_VOLTAGE V-THRUST_VOLTAGE = texas:INA219: TI INA219 Voltage/Current/Power monitor with I2C Datasheet <http://www.ti.com/lit/ds/symlink/ina219.pdf>
BME280 = BME280ComponentLibrary:BME280; PROD_ID: IC-13090
C1-C35 C37-C58 C60 C61 C63 C65 C67 C68 C77 C78 C81-C93 C95-C100 = resistor:C-US: CAPACITOR, American symbol
C36 C62 = resistor:CPOL-US: POLARIZED CAPACITOR, American symbol
CPU_PWR DEPTH_SENS THRUST1-THRUST8 = molex:KK254_VERT_4PIN: KK® 254 Wire-to-Board Header, Vertical, with Friction Lock, 4 Circuits, Gold (Au) Plating Part Number: 22-29-2041 http://www.molex.com/molex/products/datasheet.jsp?part=active/0022292041_PCB_HEADERS.xml
I2C_SHIFT = texas:PCA9306: TI I2C/SMBus Level Shifter Bidirectional 5V <-> 3V3 Datasheet <http://www.ti.com/lit/ds/symlink/pca9306.pdf>
JP1 = pinhead:PINHD-1X2: PIN HEADER
JP2 = molex:2_SUPERSABRE: Molex SuperSabre 2-pin vertical header
L1 L2 = resistor:L-US: INDUCTOR, American symbol
R1-R3 R7 R8 R10-R12 R14-R18 R21 R23-R25 R30-R35 R38 R40 = resistor:R-US_: RESISTOR, American symbol
THRUSTER_CURR_ADC = texas:ADS7828: Texas Instruments ADS7828 8-channel 12-bit I2C ADC Datasheet <http://www.ti.com/lit/ds/symlink/ads7828.pdf>
TVS1-TVS3 = diode:ESD12VD3B: MC Semi ESD12VD3B 12V TVS ESD protection Datasheet <http://www.mouser.com/ds/2/258/ESD12VD3B(SOD-323)-478460.pdf>
U1 = NXP:PCA9685: 16-channel 12-bit PWM I2C interface Internal Oscillator 40Hz to 1kHz Can be totem pole or open collector 2.3V to 5.5V; PROD_ID: IC-12240
U$1 U$66 = transistors:SSM3J353F: Toshiba SSM3J353F Small signal PMOS Datasheet <http://www.mouser.com/ds/2/408/SSM3J353F_datasheet_en_20161219-981025.pdf>
U$2 U$4 U$8 U$11 U$14 U$17 U$19 U$23 U$29 U$35 U$39 = allegro:ACS713
U$3 = texas:TIVA-C_EVAL: Texas Instruments Tiva-C TM4C123G LaunchPad Evaluation Board Part number EK-TM4C123GXL Datasheet <http://www.ti.com/lit/ug/spmu296/spmu296.pdf> Microcontroller <http://www.ti.com/lit/ds/spms376e/spms376e.pdf>
U$5 = littelfuse:BOWED-1.25"-FUSECLIPS: Littelfuse 1.25" fuse clips with bowed leads
U$6 U$9 U$12 U$15 U$18 U$20 U$27 U$36 U$37 U$40 = littelfuse:154-OMNI_BLOK: Littelfuse NANO2 Series 154 Omni-Blok fuseholder Datasheet <http://www.mouser.com/ds/2/240/Littelfuse_Fuse_154_154T_154L_154TL_Datasheet.pdf-309941.pdf>
U$7 U$10 U$13 U$16 U$22 U$26 U$28 U$30-U$34 U$38 U$59 = diode:VTVS: Vishay VTVS5V0ASMF to VTVS63GSMF 400W TVS diodes Datasheet <http://www.mouser.com/ds/2/427/vtvs5v0asmf-1078013.pdf>
U$45 = NXP:74LVC1G14: Nexperia 74LVC1G14 Single Schmitt trigger inverter Datasheet <http://www.mouser.com/ds/2/302/74LVC1G14_Q100-839654.pdf>